# Altium schematic sheet XC Tail Light Driver.SchDoc
size A4
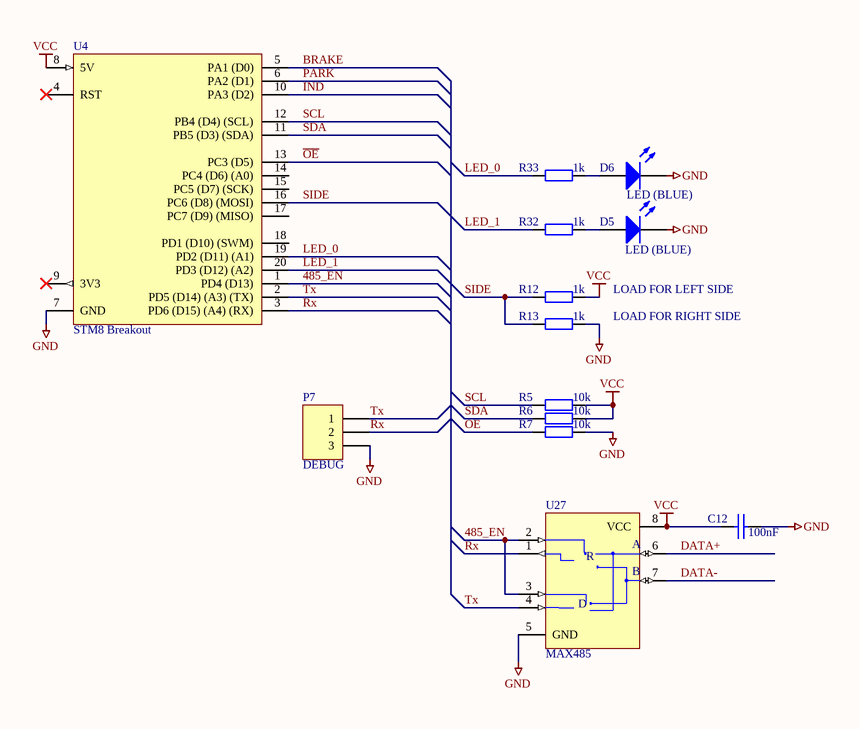
[diagram p0: XC Tail Light Driver.SchDoc]

## Parts
C12  100nF  [CAPACITOR 0805]
D5  LED (BLUE)  [LED(3D) 3MM VERTICAL (GREEN)]
D6  LED (BLUE)  [LED(3D) 3MM VERTICAL (GREEN)]
P7  DEBUG  [Pin Header 1x3 TH Pitch 2.54mm]
R5  10k  [RESISTOR 0805]
R6  10k  [RESISTOR 0805]
R7  10k  [RESISTOR 0805]
R12  1k  [RESISTOR 0805]
R13  1k  [RESISTOR 0805]
R32  1k  [RESISTOR 0805]
R33  1k  [RESISTOR 0805]
U4  STM8 Breakout  [STM8 Breakout]
U27  MAX485  [SO-8]

## Nets
GND: C12.2 D5.2(K) D6.2(K) P7.3 R7.1 R13.1 U4.7(GND) U27.5(GND)
VCC: C12.1 R5.1 R6.1 R12.1 U4.8(5V) U27.8(VCC)
485_EN: U4.1(PD4_(D13)) U27.2(~{RE}) U27.3(DE)
BRAKE: U4.5(PA1_(D0))
DATA+: U27.6(A)
DATA-: U27.7(B)
IND: U4.10(PA3_(D2))
LED_0: R33.2 U4.19(PD2_(D11)_(A1))
LED_1: R32.2 U4.20(PD3_(D12)_(A2))
~{OE}: R7.2 U4.13(PC3_(D5))
PARK: U4.6(PA2_(D1))
Rx: P7.2 U4.3(PD6_(D15)_(A4)_(RX)) U27.1(RO)
SCL: R5.2 U4.12(PB4_(D4)_(SCL))
SDA: R6.2 U4.11(PB5_(D3)_(SDA))
SIDE: R12.2 R13.2 U4.16(PC6_(D8)_(MOSI))
Tx: P7.1 U4.2(PD5_(D14)_(A3)_(TX)) U27.4(DI)
NetD5_1: D5.1(A) R32.1
NetD6_1: D6.1(A) R33.1

Not connected (* = marked no-connect by the designer): U4 4(RST)* 9(3V3)* 14(PC4_(D6)_(A0)) 15(PC5_(D7)_(SCK)) 17(PC7_(D9)_(MISO)) 18(PD1_(D10)_(SWM))

## Notes on the sheet
- LOAD FOR LEFT SIDE
- LOAD FOR RIGHT SIDE
- (in symbol MAX487CPA) R; D

## Library data of the parts
C12 = CAP: CAPACITOR SMD 0603; Manufacturer: Murata; Manufacturer Part No.: GCM188R71C104KA37D; value: 100nF; Mouser Part no.: 81-GCM188R71C104KA7D; Web link: http://au.mouser.com/ProductDetail/Murata/GCM188R71C104KA37D/?qs=aEuGZpxfbxWKAxwYn%252beTMg%3d%3d
D5 D6 = LED 3mm RED: 3mm RED LED; Manufacturer: Kingbright; Manufacturer Part No.: WP132XIT; Mouser Part no.: 604-WP132XIT; Farnell Part no.: 1003393; Web link: http://au.mouser.com/Search/Refine.aspx?Keyword=604-WP132XIT
P7 = Header 3: Header, 3 Pin; Manufacturer: FCI; Manufacturer Part No.: 68020-102; Mouser Part no.: 649-68020-102; Web link: http://au.mouser.com/ProductDetail/FCI/68020-102/?qs=sGAEpiMZZMs%252bGHln7q6pm44kDepmYTI87r6%2fnQtKGLI%3d
R5-R7 R12 R13 R32 R33 = Res2: Resistor; Published: 8-Jun-2000; LatestRevisionDate: 17-Jul-2002; LatestRevisionNote: Re-released for DXP Platform.; PackageReference: AXIAL-0.4; Publisher: Altium Limited; PackageDescription: Axial Device, Thru-Hole; 2 Leads; 0.4 in Pin Spacing
  R5-R7: Value: 10k
  R12 R13 R32 R33: Value: 1k
U27 = MAX487CPA: MAX485 485/422 Transceiver; LCSC Part Number: C9945